# Altium schematic sheet mcu.SchDoc
size A4
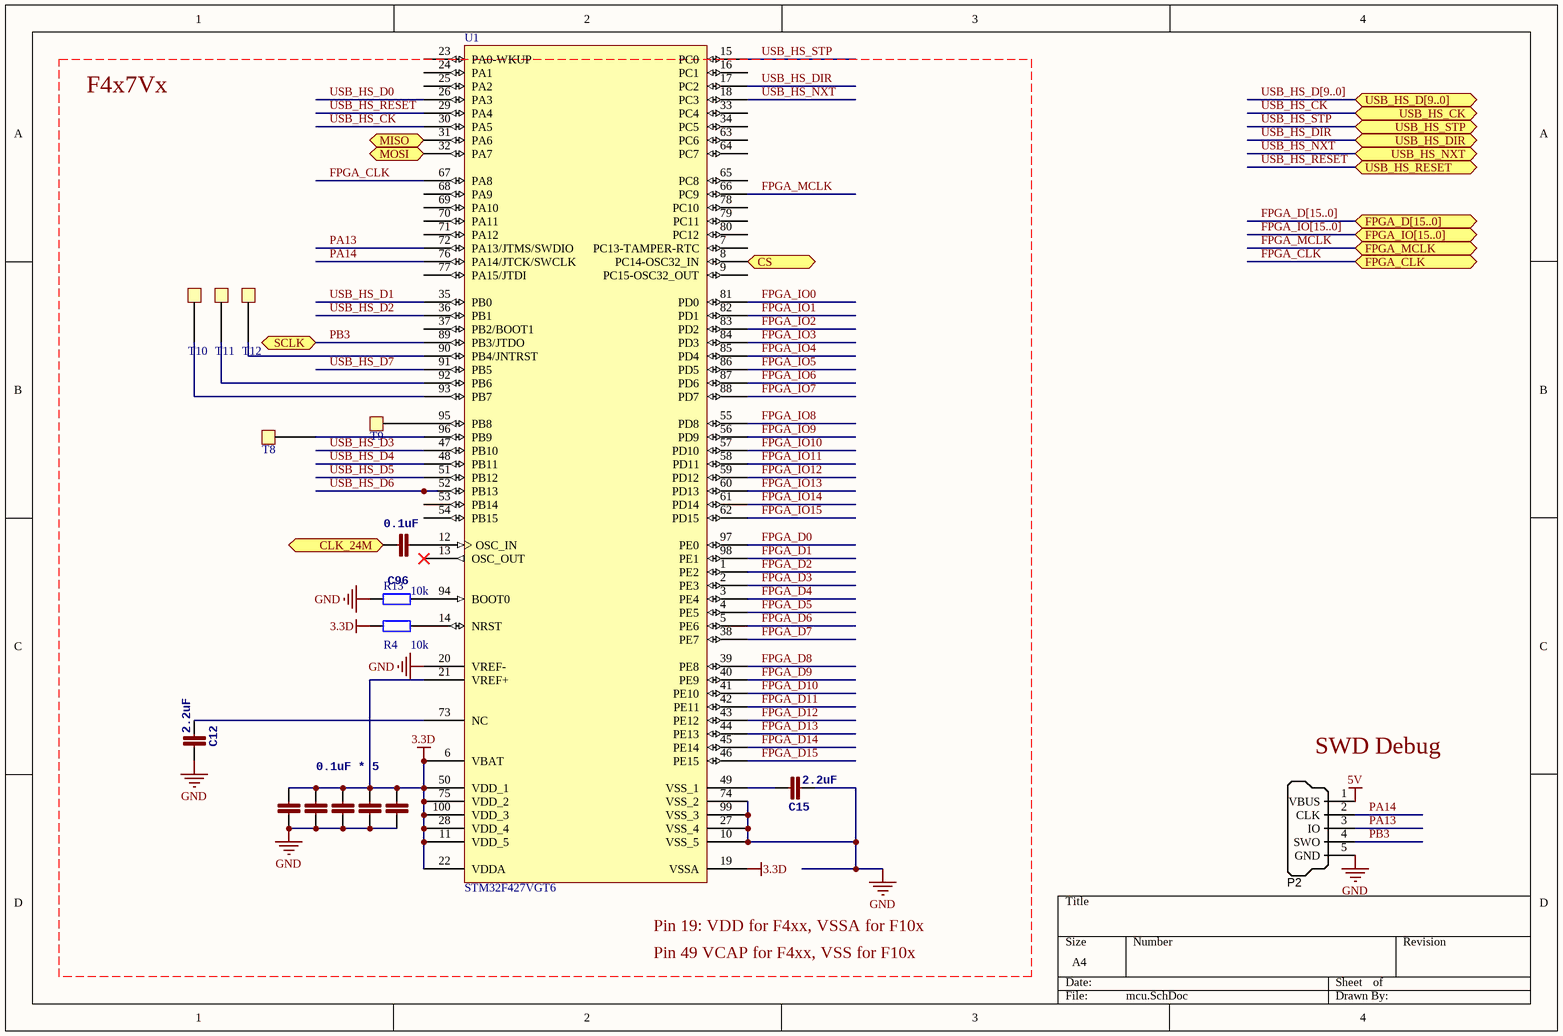
[diagram p0: mcu.SchDoc]

## Parts
C4  0.1uF * 5  [0402]
C5  1n  [0402]  (value not drawn)
C6  1n  [0402]  (value not drawn)
C12  2.2uF  [0603]
C13  1n  [0402]  (value not drawn)
C14  1n  [0402]  (value not drawn)
C15  2.2uF  [0603]
C96  0.1uF  [0402]
P2  SWD_MicroUSB  [MICRO-YZX]  (value not drawn)
R4  10k  [0402]
R13  10k  [0402]
T8  TestPad  [TestPad - 1mm]  (value not drawn)
T9  TestPad  [TestPad - 1mm]  (value not drawn)
T10  TestPad  [TestPad - 1mm]  (value not drawn)
T11  TestPad  [TestPad - 1mm]  (value not drawn)
T12  TestPad  [TestPad - 1mm]  (value not drawn)
U1  STM32F427VGT6  [LQFP100_N]

## Ports
CLK_24M, CS, FPGA_CLK, FPGA_D[15..0], FPGA_IO[15..0], FPGA_MCLK, MISO, MOSI, SCLK, USB_HS_CK, USB_HS_D[9..0], USB_HS_DIR, USB_HS_NXT, USB_HS_RESET, USB_HS_STP

## Nets
3.3D: C4.2 C5.2 C6.2 C13.2 C14.2 R4.2 U1.6(VBAT) U1.11(VDD_5) U1.19(VSSA) U1.21(VREF+) U1.22(VDDA) U1.28(VDD_4) U1.50(VDD_1) U1.75(VDD_2) U1.100(VDD_3)
5V: P2.1(VBUS)
GND: C4.1 C5.1 C6.1 C12.1 C13.1 C14.1 C15.2 P2.5(GND) R13.1 U1.10(VSS_5) U1.20(VREF-) U1.27(VSS_4) U1.74(VSS_2) U1.99(VSS_3)
CLK_24M: C96.1 ; port CLK_24M
CS: U1.8(PC14-OSC32_IN) ; port CS
FPGA_CLK: U1.67(PA8) ; port FPGA_CLK
FPGA_D0: U1.97(PE0)
FPGA_D1: U1.98(PE1)
FPGA_D2: U1.1(PE2)
FPGA_D3: U1.2(PE3)
FPGA_D4: U1.3(PE4)
FPGA_D5: U1.4(PE5)
FPGA_D6: U1.5(PE6)
FPGA_D7: U1.38(PE7)
FPGA_D8: U1.39(PE8)
FPGA_D9: U1.40(PE9)
FPGA_D10: U1.41(PE10)
FPGA_D11: U1.42(PE11)
FPGA_D12: U1.43(PE12)
FPGA_D13: U1.44(PE13)
FPGA_D14: U1.45(PE14)
FPGA_D15: U1.46(PE15)
FPGA_IO0: U1.81(PD0)
FPGA_IO1: U1.82(PD1)
FPGA_IO2: U1.83(PD2)
FPGA_IO3: U1.84(PD3)
FPGA_IO4: U1.85(PD4)
FPGA_IO5: U1.86(PD5)
FPGA_IO6: U1.87(PD6)
FPGA_IO7: U1.88(PD7)
FPGA_IO8: U1.55(PD8)
FPGA_IO9: U1.56(PD9)
FPGA_IO10: U1.57(PD10)
FPGA_IO11: U1.58(PD11)
FPGA_IO12: U1.59(PD12)
FPGA_IO13: U1.60(PD13)
FPGA_IO14: U1.61(PD14)
FPGA_IO15: U1.62(PD15)
FPGA_MCLK: U1.66(PC9) ; port FPGA_MCLK
MISO: U1.31(PA6) ; port MISO
MOSI: U1.32(PA7) ; port MOSI
PA13: P2.3(IO) U1.72(PA13/JTMS/SWDIO)
PA14: P2.2(CLK) U1.76(PA14/JTCK/SWCLK)
PB3: P2.4(SWO) U1.89(PB3/JTDO) ; port SCLK
USB_HS_CK: U1.30(PA5) ; port USB_HS_CK
USB_HS_D0: U1.26(PA3)
USB_HS_D1: U1.35(PB0)
USB_HS_D2: U1.36(PB1)
USB_HS_D3: U1.47(PB10)
USB_HS_D4: U1.48(PB11)
USB_HS_D5: U1.51(PB12)
USB_HS_D6: U1.52(PB13)
USB_HS_D7: U1.91(PB5)
USB_HS_DIR: U1.17(PC2) ; port USB_HS_DIR
USB_HS_NXT: U1.18(PC3) ; port USB_HS_NXT
USB_HS_RESET: U1.29(PA4) ; port USB_HS_RESET
USB_HS_STP: U1.15(PC0) ; port USB_HS_STP
NetC12_2: C12.2 U1.73(NC)
NetC15_1: C15.1 U1.49(VSS_1)
NetC96_2: C96.2 U1.12(OSC_IN)
NetR4_1: R4.1 U1.14(NRST)
NetR13_2: R13.2 U1.94(BOOT0)
NetT8_1: T8.1 U1.96(PB9)
NetT9_1: T9.1 U1.95(PB8)
NetT10_1: T10.1 U1.93(PB7)
NetT11_1: T11.1 U1.92(PB6)
NetT12_1: T12.1 U1.90(PB4/JNTRST)

Not connected (* = marked no-connect by the designer): U1 7(PC13-TAMPER-RTC) 9(PC15-OSC32_OUT) 13(OSC_OUT)* 16(PC1) 23(PA0-WKUP) 24(PA1) 25(PA2) 33(PC4) 34(PC5) 37(PB2/BOOT1) 53(PB14) 54(PB15) 63(PC6) 64(PC7) 65(PC8) 68(PA9) 69(PA10) 70(PA11) 71(PA12) 77(PA15/JTDI) 78(PC10) 79(PC11) 80(PC12)

## Buses and harness runs
bus FPGA_D[15..0] = port FPGA_D[15..0]
bus FPGA_IO[15..0] = port FPGA_IO[15..0]
bus USB_HS_D[9..0] = port USB_HS_D[9..0]

## Notes on the sheet
- F4x7Vx
- (near P2) SWD Debug
- (near U1) Pin 19: VDD for F4xx, VSSA for F10x
- Pin 49 VCAP for F4xx, VSS for F10x

## Library data of the parts
C4-C6 C12-C15 C96 = CAP0402-CAP: <b>Capacitor</b> / Standard 0603 ceramic capacitor, and 0.1" leaded capacitor.; PARTNO: CC0402ZRY5V7BB104
P2 = SWD_MicroUSB: Connector SMD USB Micro Type B middle mount; Manufacturer 1: Molex Inc; SCDType: undef; Package / Case: SMD; Supplier 1: Digi-Key; Supplier Part Number 1: WM17142CT-ND
R4 R13 = Res2: Resistor; Value: 0Ohm; Published: 8-Jun-2000; LatestRevisionDate: 17-Jul-2002; LatestRevisionNote: Re-released for DXP Platform.; PackageReference: AXIAL-0.4; Publisher: Altium Limited; PackageDescription: Axial Device, Thru-Hole; 2 Leads; 0.4 in Pin Spacing
U1 = STM32F103VBT6: STM32 ARM-based 32-bit MCU with 64 Kbytes Flash, 100-pin LQFP, Industrial Temperature; Published: *; DatasheetVersion: *; PackageVersion: *; PackageReference: *; Publisher: *; PackageDescription: *; ComponentLink1Description: *; ComponentLink1URL: *; ComponentLink2Description: *; ComponentLink2URL: *